# Altium schematic sheet [05] - Power Supply.SchDoc
size B
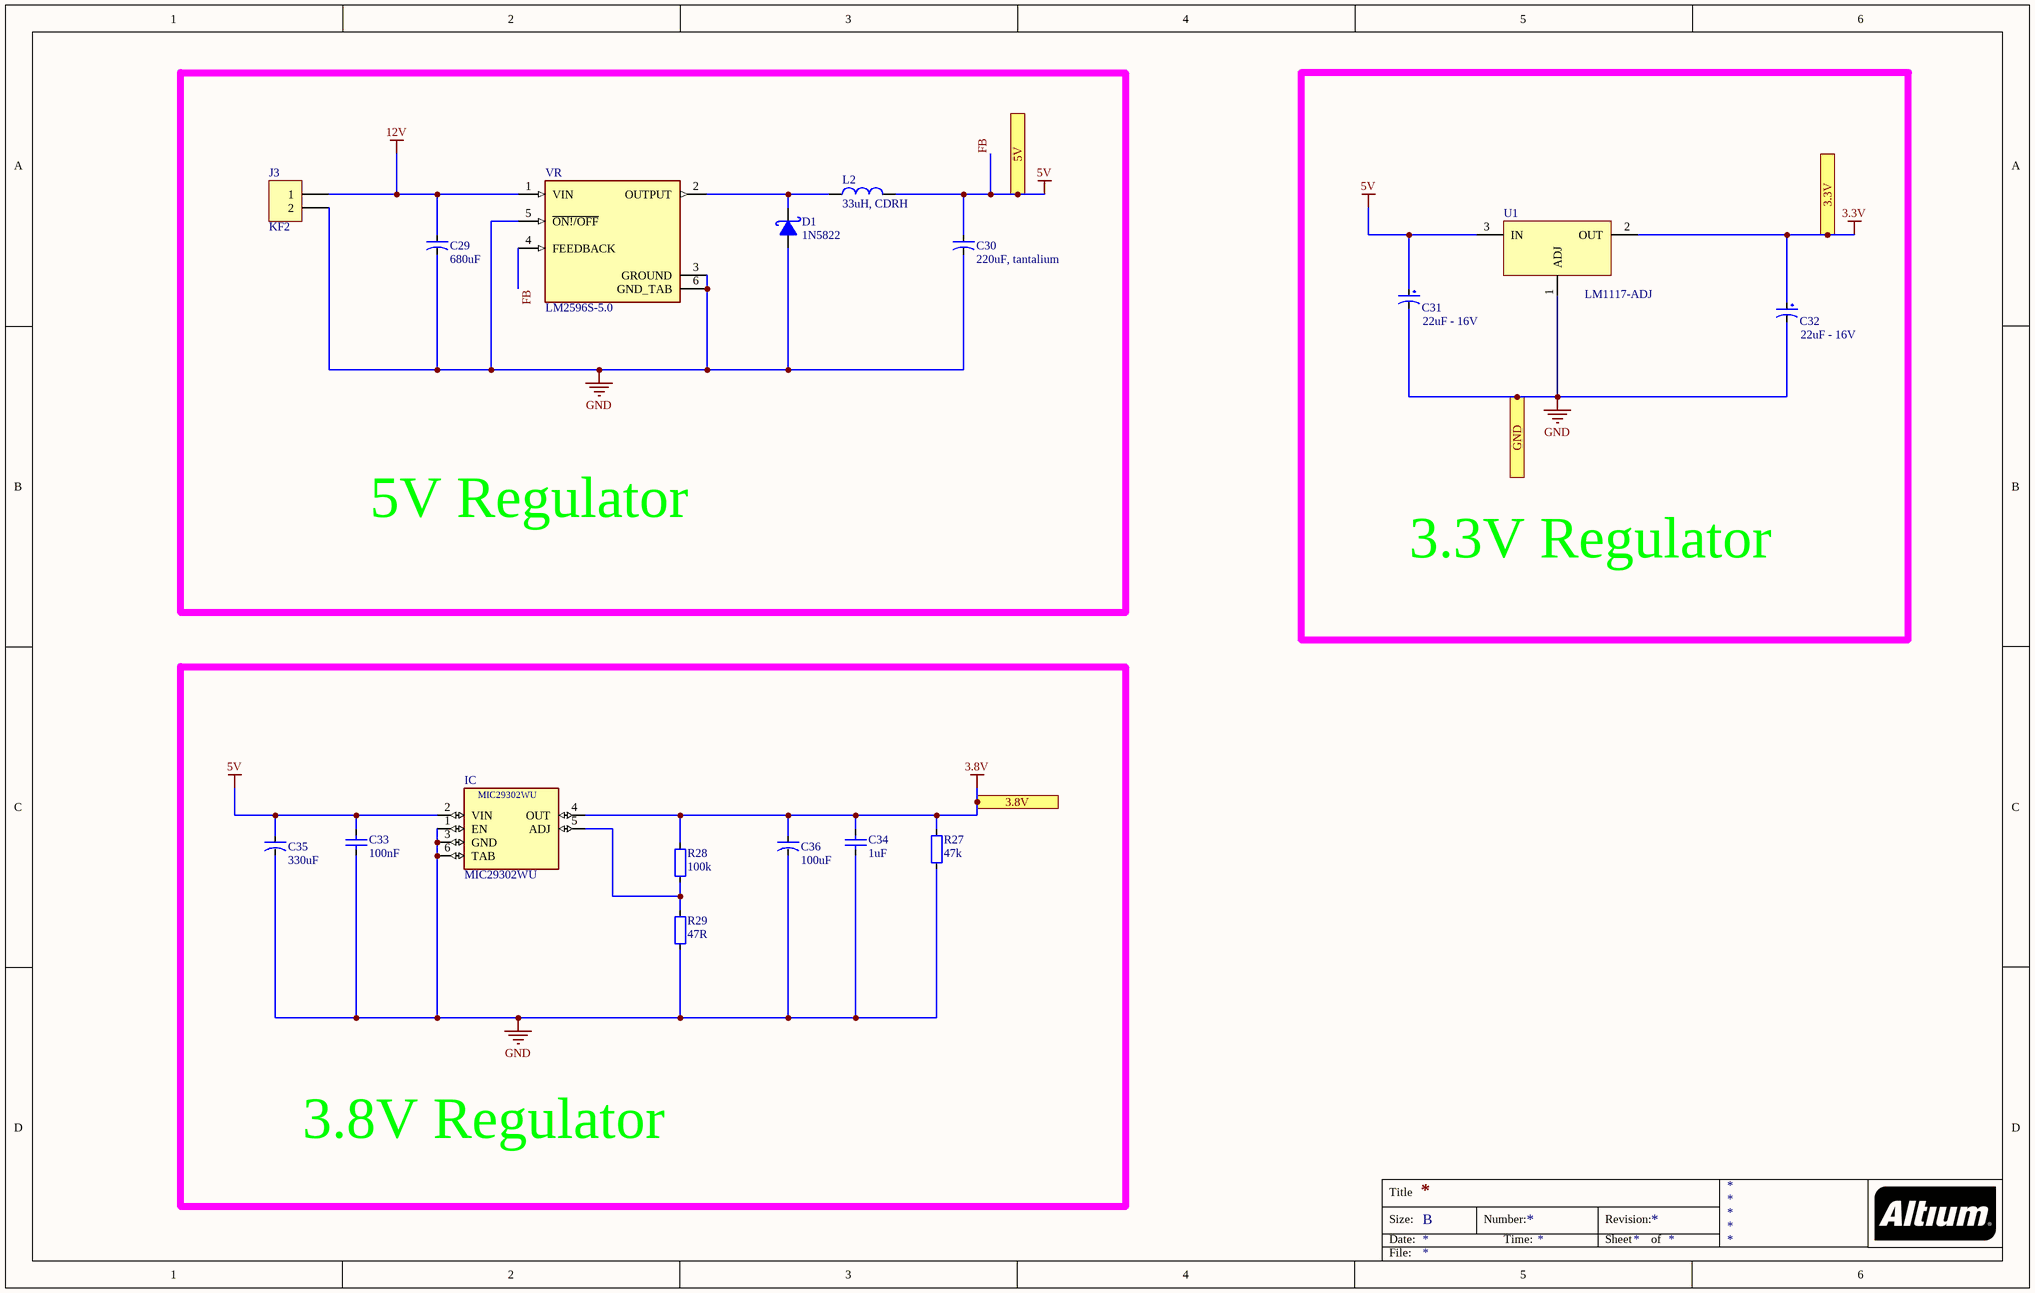
[diagram p0: [05] - Power Supply.SchDoc]

## Parts
C29  680uF  [CAP-ALU-SMD-D]
C30  220uF, tantalium  [CAP-ALU-SMD-D]
C31  22uF - 16V  [CAP-ALU-SMD-D]
C32  22uF - 16V  [CAP-ALU-SMD-D]
C33  100nF  [CAP_0805]
C34  1uF  [CAP_0805]
C35  330uF  [CAP-ALU-SMD-D]
C36  100uF  [CAP-ALU-SMD-D]
D1  1N5822  [B560C-13-F]
IC  MIC29302WU  [TO-263]
J3  KF2  [KF2-7.62]
L2  33uH, CDRH  [Inductor_SMD]
R27  47k  [RES-SMD-0603]
R28  100k  [RES-SMD-0603]
R29  47R  [RES-SMD-0603]
U1  LM1117-ADJ  [LM1117-SOP]
VR  LM2596S-5.0  [TO170P1524X483-6N]

## Ports
3.3V, 3.8V, 5V, GND

## Nets
3.3V: C32.1 U1.2(OUT) ; port 3.3V
3.8V: C34.2 C36.1 IC.4(OUT) R27.2 R28.2 ; port 3.8V
12V: C29.1 J3.1 VR.1(VIN)
FB: C30.1 C31.1 C33.2 C35.1 IC.2(VIN) L2.2 U1.3(IN) VR.4(FEEDBACK) ; port 5V  [also labelled 5V]
GND: C29.2 C30.2 C31.2 C32.2 C33.1 C34.1 C35.2 C36.2 D1.1(A) IC.1(EN) IC.3(GND) IC.6(TAB) J3.2 R27.1 R29.1 U1.1(ADJ) VR.3(GROUND) VR.5(~{ON!/OFF}) VR.6(GND_TAB) ; port GND
NetD1_2: D1.2(K) L2.1 VR.2(OUTPUT)
NetIC_5: IC.5(ADJ) R28.1 R29.2

## Notes on the sheet
- 5V Regulator
- 3.3V Regulator
- 3.8V Regulator
- Title
- Size:
- Date:
- B
- Number:
- Time:
- Revision:
- Sheet
- of
- File:

## Library data of the parts
C29 C30 C35 C36 = CAP-ALU-SMD: Polarized Capacitor (Axial); Published: 8-Jun-2000; LatestRevisionDate: 17-Jul-2002; LatestRevisionNote: Re-released for DXP Platform.; PackageReference: POLAR0.8; Publisher: Altium Limited
C31 C32 = Cap_ALU_Smd: Capacitor ALU SMD; ComponentLink1Description: http://linhkienviet.vn/tu-nhom-22uf-25v-5x5-4mm; ComponentLink1URL: http://linhkienviet.vn/tu-nhom-22uf-25v-5x5-4mm
C33 C34 = CapSMD: Capacitor; Value: 33p; Published: 8-Jun-2000; LatestRevisionDate: 17-Jul-2002; LatestRevisionNote: Re-released for DXP Platform.; PackageReference: RAD-0.3; Publisher: Altium Limited
D1 = 1N5822: Schottky Rectifiers; Value: Diode c?m 1N5408
IC = MIC29302WU: Linear Voltage Regulator IC 1 Output 3A TO-263-5; MF: Microchip Technology; Package: TO-263-6 Microchip Technology; Price: None; MP: MIC29302WU; Availability: Unavailable; SnapEDA_Link: https://www.snapeda.com/parts/MIC29302WU/Microchip/view-part/4422516/?ref=snap; Value: *
J3 = KF2: Manufacturer: Würth Elektronik eiSos GmbH; partNo: 691103110002; ComponentLink1 Description: Manufacturer; ComponentLink2 Description: Datasheet; NoPins: 2; Created Date: 29 October 2013; ComponentLink1URL: http://www.we-online.com; ComponentLink2URL: http://katalog.we-online.de/em/datasheet/6911031100xx.pdf; Created by: Karrer Zheng
L2 = L1: Inductor; Value: 150 mH
R27-R29 = Resistor - SMD: Resistor; Manufacturer: Generic Components; Class: Passive; Published: 08/06/2000; Publisher: Altium Hobart Technology Centre
U1 = LM1117-ADJ: 800mA Low-Dropout Linear Regulator; Creator: Nguyen Ba Bien; Website: http://group3i.net
VR = LM2596S-5.0: SIMPLE SWITCHER&reg; 4.5V to 40V, 3A Low Component Count Step-Down Regulator 5-DDPAK/TO-263; MF: Texas Instruments; MP: LM2596S-5.0/NOPB; DigiKey-Purchase-URL: https://snapeda.com/shop?store=DigiKey&id=15588; Mouser-Purchase-URL: https://snapeda.com/shop?store=Mouser&id=15588; SnapEDA_Link: https://www.snapeda.com/parts/LM2596S-5.0/NOPB/Texas%20Instruments/view-part/15588/?ref=snap; Price: None; Value: *; Availability: Good; Texas_Instruments-Purchase-URL: https://snapeda.com/shop?store=Texas+Instruments&id=15588; Package: TO-263-5 Texas Instruments